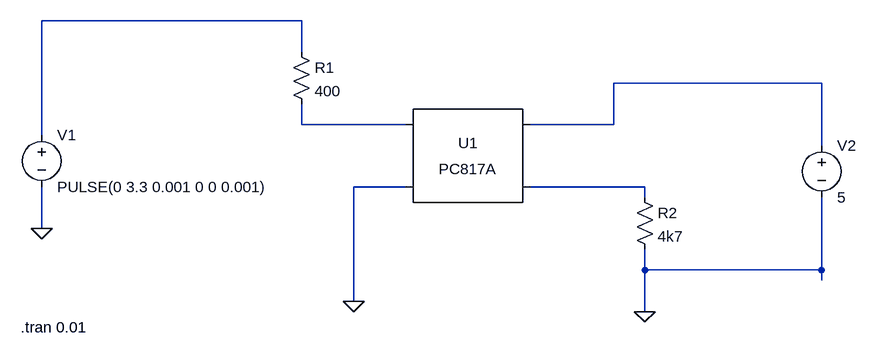
[diagram p0: schematic opto.asc]
opto.asc, the LTspice schematic file:
Version 4
SHEET 1 880 680
WIRE -64 -48 -464 -48
WIRE -64 0 -64 -48
WIRE 736 48 416 48
WIRE -64 112 -64 80
WIRE 96 112 -64 112
WIRE 416 112 416 48
WIRE 416 112 288 112
WIRE -464 128 -464 -48
WIRE 736 144 736 48
WIRE 96 208 16 208
WIRE 464 208 288 208
WIRE 464 224 464 208
WIRE -464 272 -464 208
WIRE 464 336 464 304
WIRE 736 336 736 224
WIRE 736 336 464 336
WIRE 736 352 736 336
WIRE 16 384 16 208
WIRE 464 400 464 336
FLAG 16 384 0
FLAG -464 272 0
FLAG 464 400 0
SYMBOL Optos\\PC817A 192 160 R0
SYMATTR InstName U1
SYMBOL res -80 -16 R0
SYMATTR InstName R1
SYMATTR Value 400
SYMBOL voltage -464 112 R0
WINDOW 123 0 0 Left 2
WINDOW 39 0 0 Left 2
SYMATTR Value2 ""
SYMATTR SpiceLine ""
SYMATTR InstName V1
SYMATTR Value PULSE(0 3.3 0.001 0 0 0.001)
SYMBOL res 448 208 R0
SYMATTR InstName R2
SYMATTR Value 4k7
SYMATTR SpiceLine ""
SYMBOL voltage 736 128 R0
WINDOW 123 0 0 Left 2
WINDOW 39 0 0 Left 2
SYMATTR Value2 ""
SYMATTR SpiceLine ""
SYMATTR InstName V2
SYMATTR Value 5
TEXT -496 424 Left 2 !.tran 0.01

The netlist it stands for:
* opto.asc
XU1 N003 0 N002 N004 PC817 Igain=1m
R1 N001 N003 400
V1 N001 0 PULSE(0 3.3 0.001 0 0 0.001)
R2 N004 0 4k7
V2 N002 0 5
.tran 0.01
.lib PC817.sub
.backanno
.end